# EAGLE schematic space_charge (EAGLE 9.6.2)
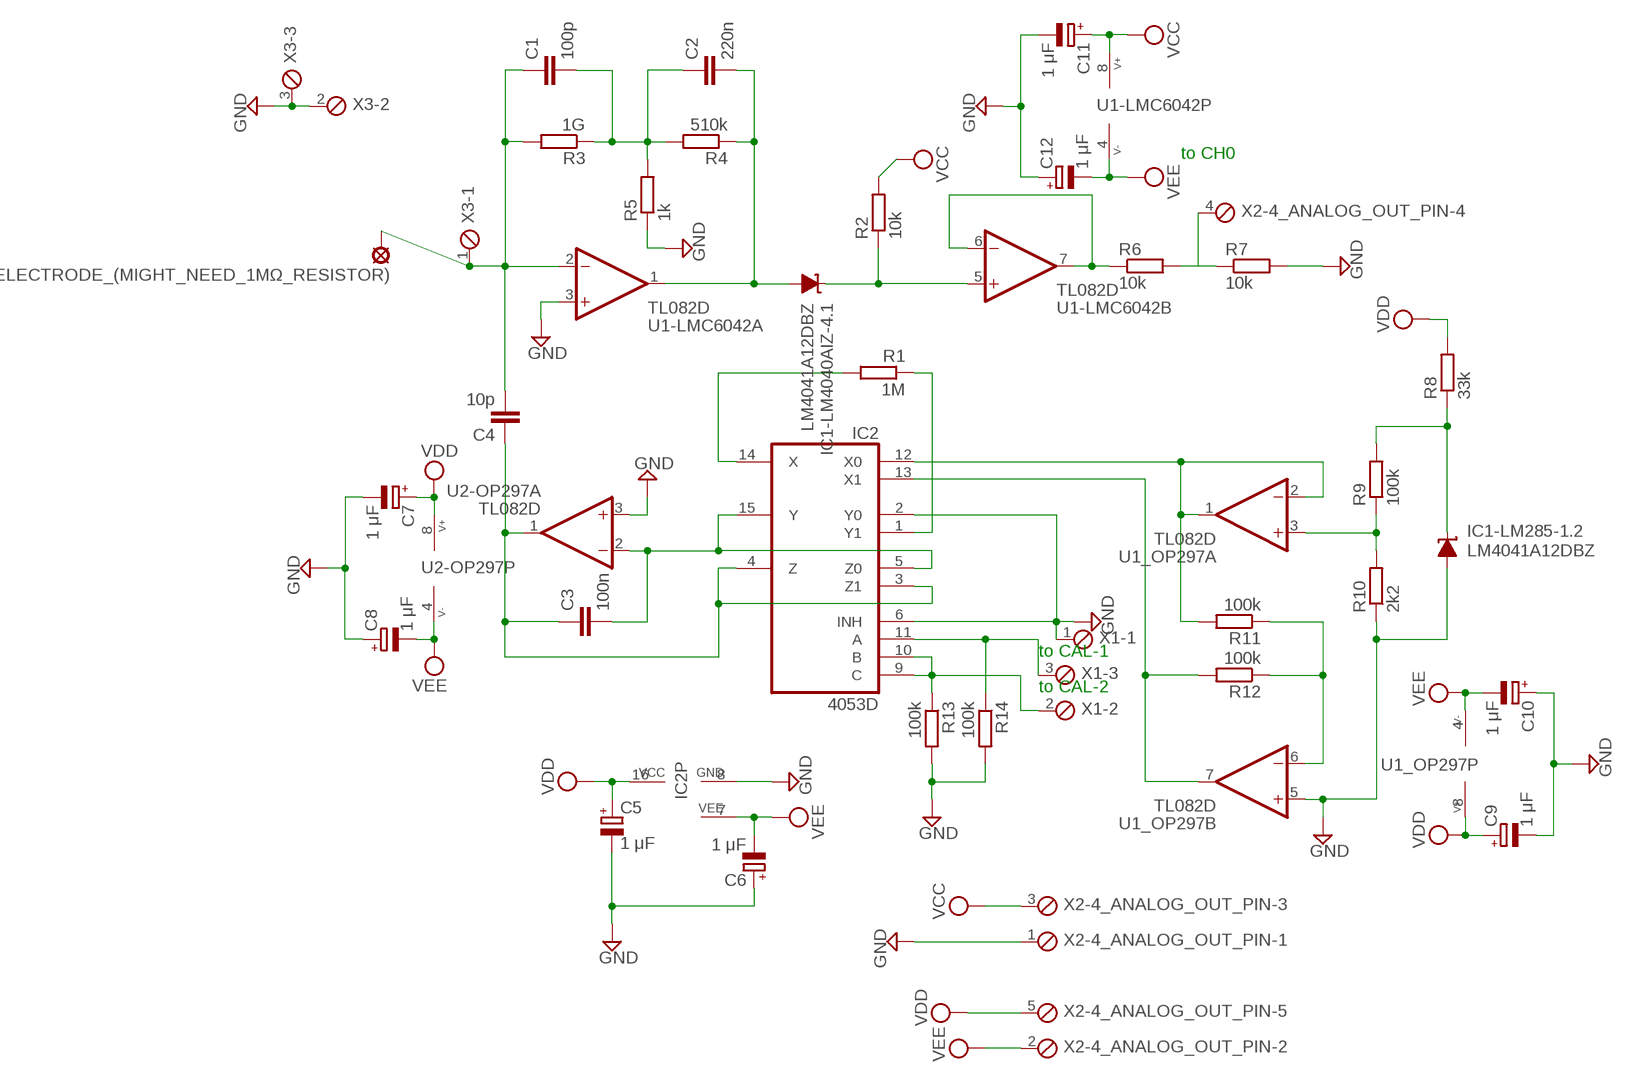
[diagram p0: schematic, sheet 1]

## Parts
C1  100p  C-EUC1206  [C1206]
C2  220n  C-EUC1206  [C1206]
C3  100n  C-EUC1206  [C1206]
C4  10p  C-EUC1206  [C1206]
C5  1 μF  CPOL-EUA/3216-18R  [A/3216-18R]
C6  1 μF  CPOL-EUA/3216-18R  [A/3216-18R]
C7  1 μF  CPOL-EUA/3216-18R  [A/3216-18R]
C8  1 μF  CPOL-EUA/3216-18R  [A/3216-18R]
C9  1 μF  CPOL-EUA/3216-18R  [A/3216-18R]
C10  1 μF  CPOL-EUA/3216-18R  [A/3216-18R]
C11  1 μF  CPOL-EUA/3216-18R  [A/3216-18R]
C12  1 μF  CPOL-EUA/3216-18R  [A/3216-18R]
IC1-LM285-1.2  LM4041A12DBZ  [DBZ_R-PDSO-G3]
IC1-LM4040AIZ-4.1  LM4041A12DBZ  [DBZ_R-PDSO-G3]
IC2  4053D  [SO16]
R1  1M  R-EU_R1206  [R1206]
R2  10k  R-EU_R1206  [R1206]
R3  1G  R-EU_R1206  [R1206]
R4  510k  R-EU_R1206  [R1206]
R5  1k  R-EU_R1206  [R1206]
R6  10k  R-EU_R1206  [R1206]
R7  10k  R-EU_R1206  [R1206]
R8  33k  R-EU_R1206  [R1206]
R9  100k  R-EU_R1206  [R1206]
R10  2k2  R-EU_R1206  [R1206]
R11  100k  R-EU_R1206  [R1206]
R12  100k  R-EU_R1206  [R1206]
R13  100k  R-EU_R1206  [R1206]
R14  100k  R-EU_R1206  [R1206]
TO_ELECTRODE_(MIGHT_NEED_1MΩ_RESISTOR)  LSP10  [LSP10]
U1-LMC6042  TL082D  [SO08]
U1_OP297  TL082D  [SO08]
U2-OP297  TL082D  [SO08]
X1  MPT3  [3POL254]
X2-4_ANALOG_OUT_PIN  MPT5  [5POL254]
X3  MPT3  [3POL254]

## Nets
CAL-1: IC2.11(A) R14.1 X1.3
CAL-2: IC2.9(C) IC2.10(B) R13.1 X1.2
GND: C5.- C6.+ C7.- C8.+ C9.- C10.+ C11.- C12.+ IC1-LM285-1.2.2(A) IC2.2(Y0) IC2.6(INH) IC2.8(GND) R5.1 R7.2 R10.1 R13.2 R14.2 U1-LMC6042.3(A:+IN) U1_OP297.5(B:+IN) U2-OP297.3(A:+IN) X1.1 X2-4_ANALOG_OUT_PIN.1 X3.2 X3.3
N$1: C1.1 C4.2 R3.2 TO_ELECTRODE_(MIGHT_NEED_1MΩ_RESISTOR).MP U1-LMC6042.2(A:-IN) X3.1
N$2: C1.2 C2.1 R3.1 R4.2 R5.2
N$3: C2.2 IC1-LM4040AIZ-4.1.2(A) R4.1 U1-LMC6042.1(A:OUT)
N$4: IC1-LM4040AIZ-4.1.1(C) R2.1 U1-LMC6042.5(B:+IN)
N$5: R6.1 U1-LMC6042.6(B:-IN) U1-LMC6042.7(B:OUT)
N$6: R6.2 R7.1 X2-4_ANALOG_OUT_PIN.4
N$7: IC2.14(X) R1.2
N$8: IC2.1(Y1) R1.1
N$9: C3.2 IC2.5(Z0) IC2.15(Y) U2-OP297.2(A:-IN)
N$10: IC2.12(X0) R11.2 U1_OP297.1(A:OUT) U1_OP297.2(A:-IN)
N$11: R11.1 R12.1 U1_OP297.6(B:-IN)
N$12: IC2.13(X1) R12.2 U1_OP297.7(B:OUT)
N$13: R9.1 R10.2 U1_OP297.3(A:+IN)
N$14: IC1-LM285-1.2.1(C) R8.1 R9.2
N$15: C3.1 C4.1 IC2.3(Z1) IC2.4(Z) U2-OP297.1(A:OUT)
VCC: C11.+ R2.2 U1-LMC6042.8(P:V+) X2-4_ANALOG_OUT_PIN.3
VDD: C5.+ C7.+ C9.+ IC2.16(VCC) R8.2 U1_OP297.8(P:V+) U2-OP297.8(P:V+) X2-4_ANALOG_OUT_PIN.5
VEE: C6.- C8.- C10.- C12.- IC2.7(VEE) U1-LMC6042.4(P:V-) U1_OP297.4(P:V-) U2-OP297.4(P:V-) X2-4_ANALOG_OUT_PIN.2
Unconnected: U2-OP297.5(B:+IN) U2-OP297.6(B:-IN) U2-OP297.7(B:OUT)

## Notes on the sheet
- to CH0
- to CAL-1
- to CAL-2

## Library data of the parts
C1-C4 = rcl:C-EU: CAPACITOR, European symbol
C5-C12 = rcl:CPOL-EU: POLARIZED CAPACITOR, European symbol
IC1-LM285-1.2 IC1-LM4040AIZ-4.1 = texas:LM4041: PRECISION MICROPOWER SHUNT VOLTAGE REFERENCE Source: http://focus.ti.com/lit/ds/slcs146e/slcs146e.pdf; MPN: LM4041A12IDBZR; OC_FARNELL: 1407949; OC_NEWARK: 58K5875
IC2 = 40xx:4053: Triple 2-channel ANALOG MULTIPLEXER
R1 R6-R10 = rcl:R-EU_: RESISTOR, European symbol
R2-R5 R11-R14 = resistor:R-EU_: RESISTOR, European symbol
TO_ELECTRODE_(MIGHT_NEED_1MΩ_RESISTOR) = solpad:LSP10: SOLDER PAD drill 1.0 mm, distributor Buerklin, 12H555
U1-LMC6042 U1_OP297 U2-OP297 = op-amp:TL082: JFET OP-AMP - Dual
X1 X3 = con-phoenix-254:MPT3: PHOENIX CONNECTOR; OC_FARNELL: unknown; OC_NEWARK: unknown
X2-4_ANALOG_OUT_PIN = con-phoenix-254:MPT5: PHOENIX CONNECTOR; OC_FARNELL: unknown; OC_NEWARK: unknown